# Altium schematic sheet Scrolling_LEDs.SchDoc
size A4; PageSetup: Record=PageOptions|CenterHorizontal=True|CenterVertical=True|PrintScale=1.00|XCorrection=1.00|YCorrection=1.00|PrintKind=0|BorderSize=5000000|LeftOffset=0|BottomOffset=0|Orientation=2|PaperLength=1000|PaperWidth=1000|Scale=100|PaperSource=7|PrintQuality=-4|MediaType=1|DitherType=10|PaperKind=A4|PrintScaleMode=1; Organization: Altium Limited; Address1: 3 Minna Close; Address2: Belrose; Address3: NSW 2086; Address4: Australia
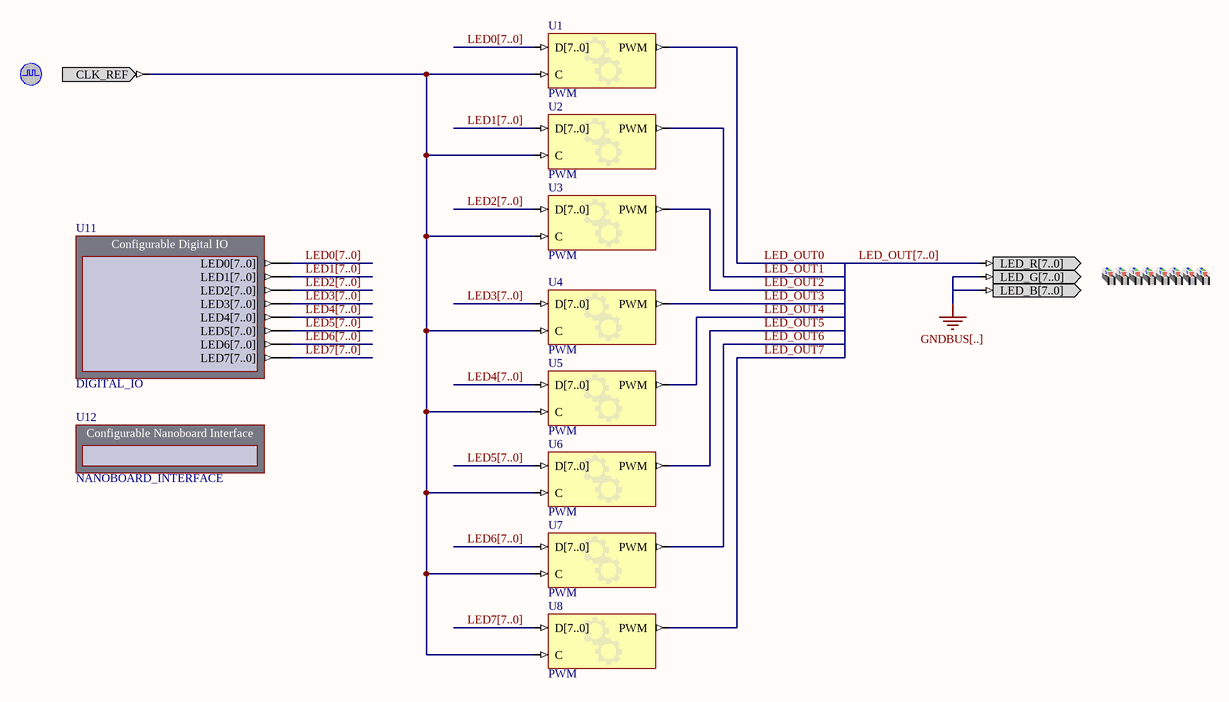
[diagram p0: Scrolling_LEDs.SchDoc]

## Parts
(Parts that share a designator on the sheet are numbered #1, #2 ... from top to bottom, then left to right.)
?#1  CLOCK_REFERENCE  (value not drawn)
?#2  LEDS_RGB  (value not drawn)
U1  PWM
U2  PWM
U3  PWM
U4  PWM
U5  PWM
U6  PWM
U7  PWM
U8  PWM
U11  DIGITAL_IO
U12  NANOBOARD_INTERFACE

## Nets
GNDBUS[..]: ?#2.LED_B[7..0] ?#2.LED_G[7..0]
LED0[7..0]: U1.D[7..0] U11.LED0[7..0]
LED1[7..0]: U2.D[7..0] U11.LED1[7..0]
LED2[7..0]: U3.D[7..0] U11.LED2[7..0]
LED3[7..0]: U4.D[7..0] U11.LED3[7..0]
LED4[7..0]: U5.D[7..0] U11.LED4[7..0]
LED5[7..0]: U6.D[7..0] U11.LED5[7..0]
LED6[7..0]: U7.D[7..0] U11.LED6[7..0]
LED7[7..0]: U8.D[7..0] U11.LED7[7..0]
LED_OUT0: U1.PWM
LED_OUT1: U2.PWM
LED_OUT2: U3.PWM
LED_OUT3: U4.PWM
LED_OUT4: U5.PWM
LED_OUT5: U6.PWM
LED_OUT6: U7.PWM
LED_OUT7: U8.PWM
LED_OUT[7..0]: ?#2.LED_R[7..0]
Net?#1_CLK_REF: ?#1.CLK_REF U1.C U2.C U3.C U4.C U5.C U6.C U7.C U8.C

## Buses and harness runs
bus LED0[7..0]
bus LED1[7..0]
bus LED2[7..0]
bus LED3[7..0]
bus LED4[7..0]
bus LED5[7..0]
bus LED6[7..0]
bus LED7[7..0]
bus LED_OUT[7..0]

## Notes on the sheet
- Labels drawn without touching a wire or pin: GNDBUS[..]
- Title
- Size:
- Date:
- A4
- Number:
- Time:
- Revision:
- Sheet
- of
- File:

## Library data of the parts
?#1 = CLOCK_REFERENCE: Global System Clock Reference Supply; PortComponent: True; Published: 19-Nov-2003; Publisher: Altium Limited; HelpURL: TR0143 Technical Reference Manual for Altium's Desktop NanoBoard NB2DSK01.pdf#page=41
?#2 = LEDS_RGB: LEDS RGB; PortComponent: True; Published: 11-Mar-2009; Publisher: Altium Limited
U1-U8 = PWM: Configurable PWM; ConfiguratorName: GENERIC_PWM; ConfigurationParameters: {}Version[1.0]{}Width[8]{}Prescaler[1]{}; LastRevisionNo: 1.00.00; Published: 8-Apr-2009; Publisher: Altium Limited
U11 = DIGITAL_IO: Configurable Digital IO; NEXUS_CORE: Instrument; NEXUS_JTAG_DEVICE: True; NEXUS_JTAG_ORDER: 0; ConfigurationParameters: {}Version[2.0]{}StorageType[1]{}InterfaceType[Parallel]{}SchCompWidth[140]{}NoInputs[ ]{}Output0Name[LED0{1}7..0{2}]{}Output0Width[8]{}Output0InitValue[0]{}Output0Kind[Slider]{}Output1Name[LED1{1}7..0{2}]{}Output1Width[8]{}Output1InitValue[0]{}Output1Kind[Slider]{}Output2Name[LED2{1}7..0{2}]{}Output2Width[8]{}Output2InitValue[0]{}Output2Kind[Slider]{}Output3Name[LED3{1}7..0{2}]{}Output3Width[8]{}Output3InitValue[0]{}Output3Kind[Slider]{}Output4Name[LED4{1}7..0{2}]{}Output4Width[8]{}Output4InitValue[0]{}Output4Kind[Slider]{}Output5Name[LED5{1}7..0{2}]{}Output5Width[8]{}Output5InitValue[0]{}Output5Kind[Slider]{}Output6Name[LED6{1}7..0{2}]{}Output6Width[8]{}Output6InitValue[0]{}Output6Kind[Slider]{}Output7Name[LED7{1}7..0{2}]{}Output7Width[8]{}Output7InitValue[0]{}Output7Kind[Slider]{}Designator[U11]{}InternalID[0]{}; ConfiguratorName: DIGITAL_IO; ComponentLink1Description: Core &Resource Usage; ComponentLink1URL: CR0134 FPGA Instrument Resource Usage.pdf; Core Revision: 1.00.00; HelpURL: CR0179 DIGITAL_IO Configurable Digital IO Module.pdf; LastRevisionNo: 1.00.00; Published: 28-Jun-2007; Publisher: Altium Limited; UseInDSF: True
U12 = NANOBOARD_INTERFACE: Configurable Nanoboard Interface; NEXUS_CORE: Instrument; NEXUS_JTAG_DEVICE: True; NEXUS_JTAG_ORDER: 0; ConfiguratorName: DIGITAL_IO_APPLICATION; ConfigurationParameters: {}Version[1.0]{}StorageType[1]{}SubProjectPath[Scrolling_LEDs.PrjScr]{}ID[{1592EB80-ABFD-4356-85AF-B6CBF519C835}]{}DisabledInDashboard[False]{}AutoRun[False]{}; ComponentLink1Description: Core &Resource Usage; ComponentLink1URL: CR0134 FPGA Instrument Resource Usage.pdf; Core Revision: 1.00.00; LastRevisionNo: 1.00.00; Published: 06-May-2009; Publisher: Altium Limited